# Altium schematic sheet Eth.SchDoc
size A3
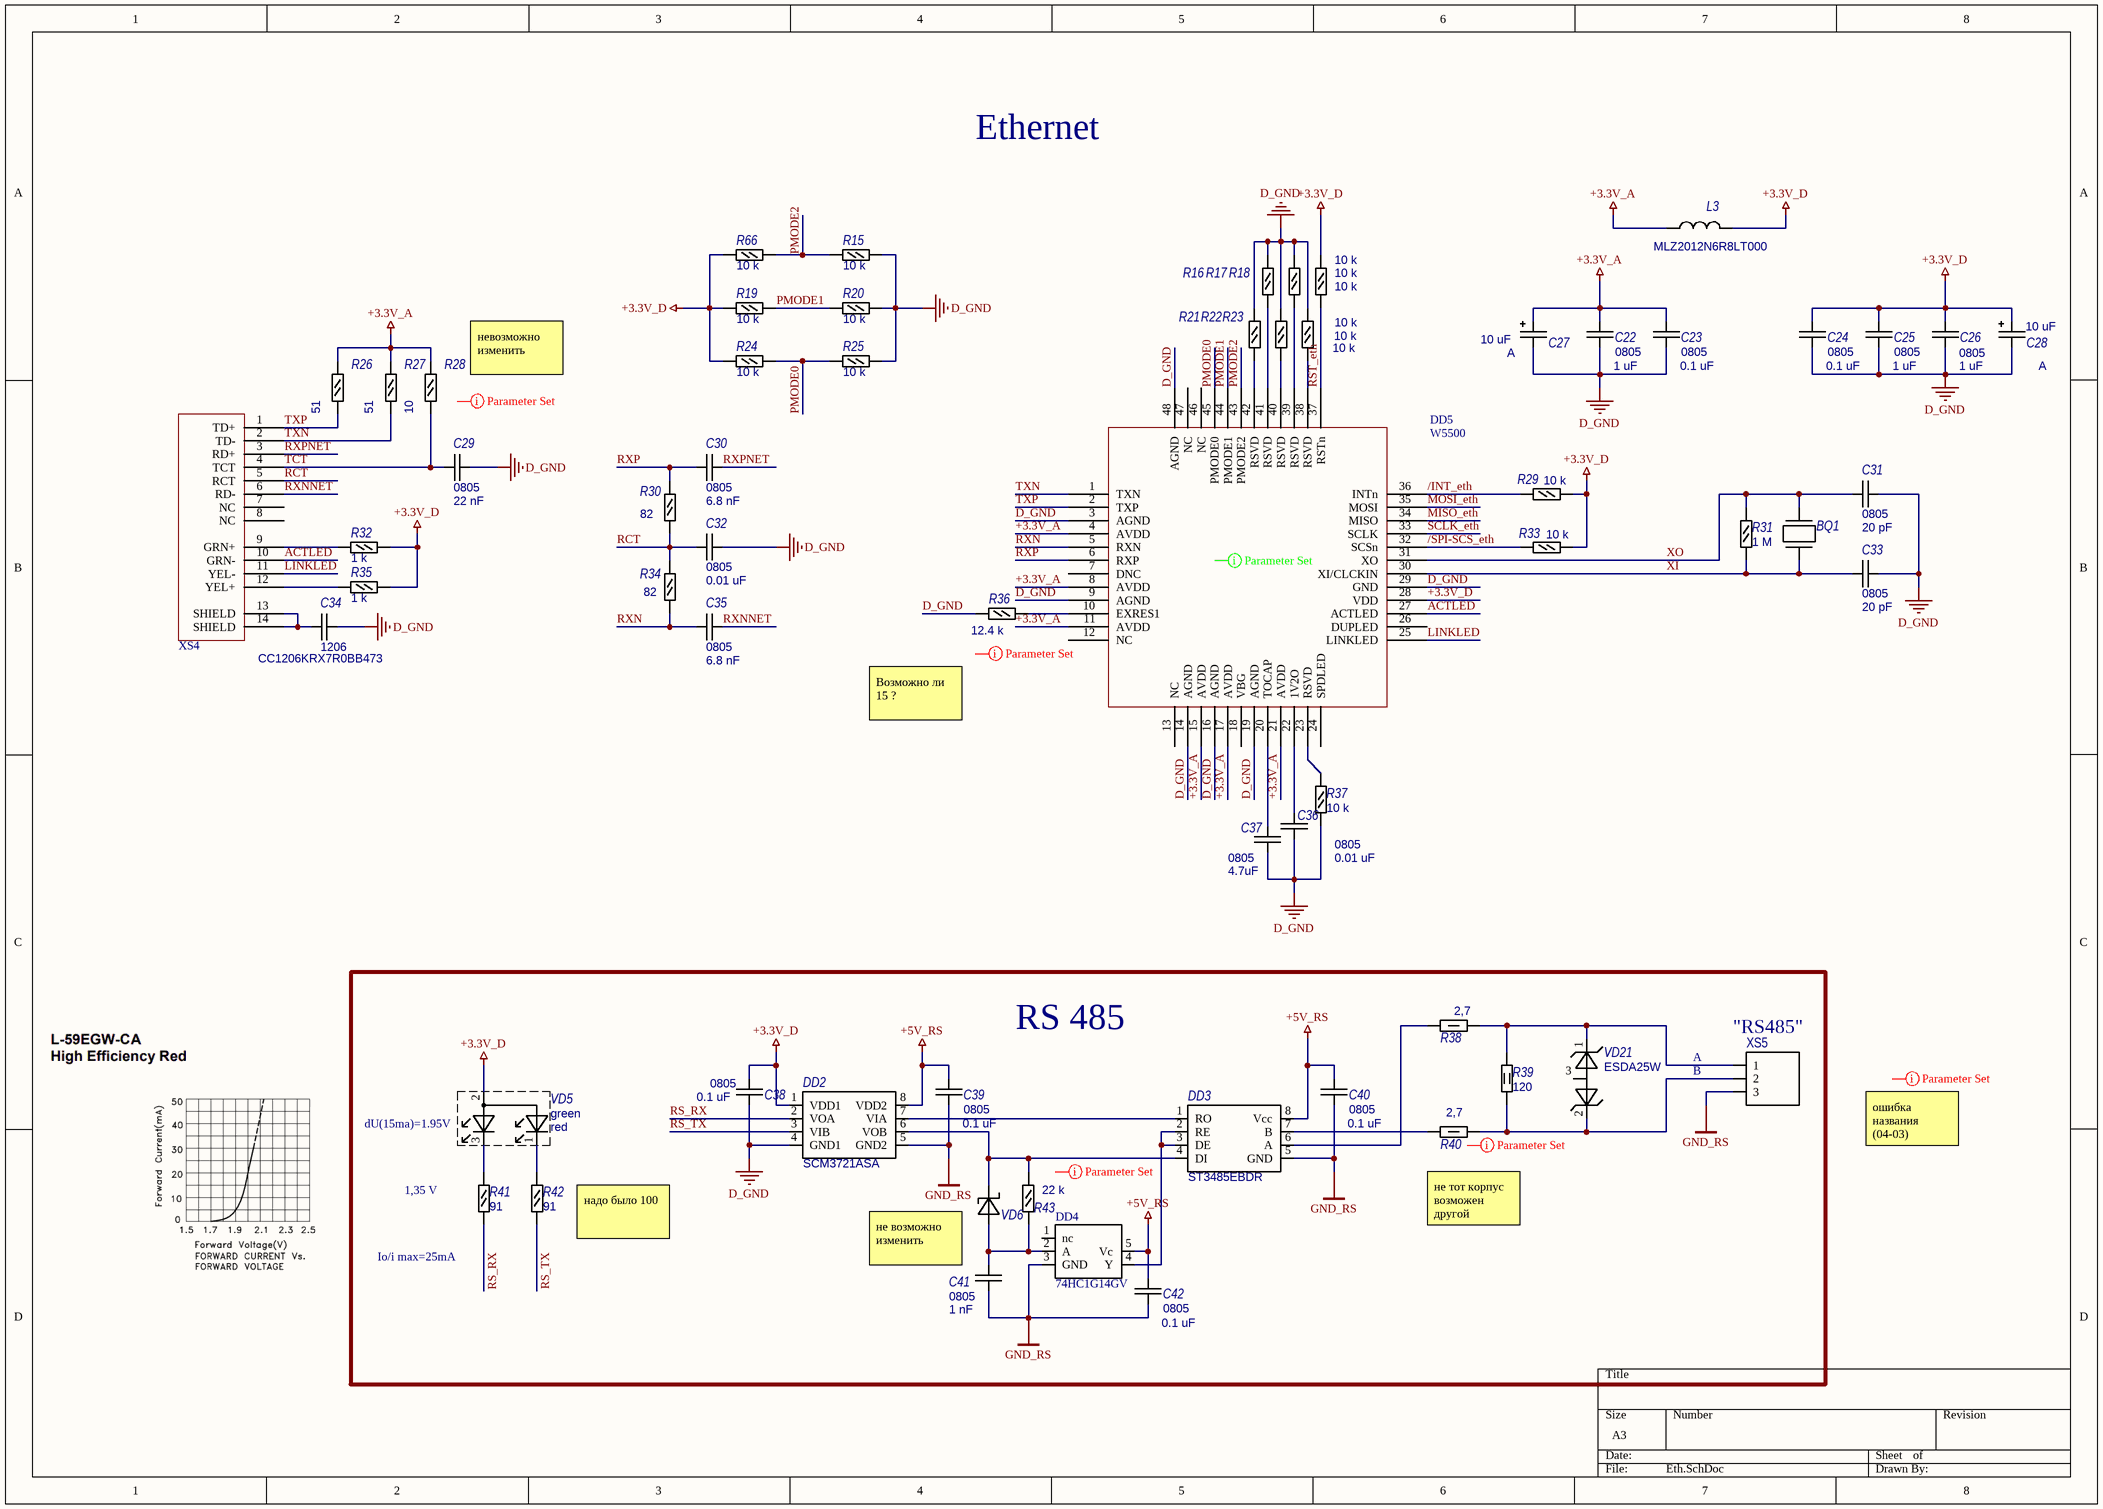
[diagram p0: Eth.SchDoc]

## Parts
BQ1  (no value)  [Xtal_HC49S]
C22  0805  Номинал: 1 uF  [CAP_0805_(2x1.25x1.3)]
C23  0805  Номинал: 0.1 uF  [CAP_0805_(2x1.25x1.3)]
C24  0805  Номинал: 0.1 uF  [CAP_0805_(2x1.25x1.3)]
C25  0805  Номинал: 1 uF  [CAP_0805_(2x1.25x1.3)]
C26  0805  Номинал: 1 uF  [CAP_0805_(2x1.25x1.3)]
C27  Корпус: A  Номинал: 10 uF  [CAP_TAN_A]  (hidden comment: TAN_A)
C28  Корпус: A  Номинал: 10 uF  [CAP_TAN_A]  (hidden comment: TAN_A)
C29  0805  Номинал: 22 nF  [CAP_0805_(2x1.25x1.3)]
C30  0805  Номинал: 6.8 nF  [CAP_0805_(2x1.25x1.3)]
C31  0805  Номинал: 20 pF  [CAP_0805_(2x1.25x1.3)]
C32  0805  Номинал: 0.01 uF  [CAP_0805_(2x1.25x1.3)]
C33  0805  Номинал: 20 pF  [CAP_0805_(2x1.25x1.3)]
C34  1206  Наименование: CC1206KRX7R0BB473  [CAP_1206_(3.2x1.6x1.5)]
C35  0805  Номинал: 6.8 nF  [CAP_0805_(2x1.25x1.3)]
C36  0805  Номинал: 0.01 uF  [CAP_0805_(2x1.25x1.3)]
C37  0805  Номинал: 4.7uF  [CAP_0805_(2x1.25x1.3)]
C38  0805  Номинал: 0.1 uF  [CAP_0805_(2x1.25x1.3)]
C39  0805  Номинал: 0.1 uF  [CAP_0805_(2x1.25x1.3)]
C40  0805  Номинал: 0.1 uF  [CAP_0805_(2x1.25x1.3)]
C41  0805  Номинал: 1 nF  [CAP_0805_(2x1.25x1.3)]
C42  0805  Номинал: 0.1 uF  [CAP_0805_(2x1.25x1.3)]
DD2  SCM3721ASA  [SOP-8]
DD3  ST3485EBDR  [SO-8_(0.15')]
DD4  74HC1G14GV  [sot-23-5]
DD5  W5500  [LQFP_48]
L3  Наименование: MLZ2012N6R8LT000  [L_0805]  (hidden comment: PBY201209T-601Y-N)
R15  Номинал: 10 k  [RES_0805_(2x1.2x0.45)_0.125Вт]  (hidden comment: 0805)
R16  Номинал: 10 k  [RES_0805_(2x1.2x0.45)_0.125Вт]  (hidden comment: 0805)
R17  Номинал: 10 k  [RES_0805_(2x1.2x0.45)_0.125Вт]  (hidden comment: 0805)
R18  Номинал: 10 k  [RES_0805_(2x1.2x0.45)_0.125Вт]  (hidden comment: 0805)
R19  Номинал: 10 k  [RES_0805_(2x1.2x0.45)_0.125Вт]  (hidden comment: 0805)
R20  Номинал: 10 k  [RES_0805_(2x1.2x0.45)_0.125Вт]  (hidden comment: 0805)
R21  Номинал: 10 k  [RES_0805_(2x1.2x0.45)_0.125Вт]  (hidden comment: 0805)
R22  Номинал: 10 k  [RES_0805_(2x1.2x0.45)_0.125Вт]  (hidden comment: 0805)
R23  Номинал: 10 k  [RES_0805_(2x1.2x0.45)_0.125Вт]  (hidden comment: 0805)
R24  Номинал: 10 k  [RES_0805_(2x1.2x0.45)_0.125Вт]  (hidden comment: 0805)
R25  Номинал: 10 k  [RES_0805_(2x1.2x0.45)_0.125Вт]  (hidden comment: 0805)
R26  Номинал: 51  [RES_0805_(2x1.2x0.45)_0.125Вт]  (hidden comment: 0805)
R27  Номинал: 51  [RES_0805_(2x1.2x0.45)_0.125Вт]  (hidden comment: 0805)
R28  Номинал: 10  [RES_0805_(2x1.2x0.45)_0.125Вт]  (hidden comment: 0805)
R29  Номинал: 10 k  [RES_0805_(2x1.2x0.45)_0.125Вт]  (hidden comment: 0805)
R30  Номинал: 82  [RES_0805_(2x1.2x0.45)_0.125Вт]  (hidden comment: 0805)
R31  Номинал: 1 M  [RES_0805_(2x1.2x0.45)_0.125Вт]  (hidden comment: 0805)
R32  Номинал: 1 k  [RES_0805_(2x1.2x0.45)_0.125Вт]  (hidden comment: 0805)
R33  Номинал: 10 k  [RES_0805_(2x1.2x0.45)_0.125Вт]  (hidden comment: 0805)
R34  Номинал: 82  [RES_0805_(2x1.2x0.45)_0.125Вт]  (hidden comment: 0805)
R35  Номинал: 1 k  [RES_0805_(2x1.2x0.45)_0.125Вт]  (hidden comment: 0805)
R36  Номинал: 12.4 k  [RES_0805_(2x1.2x0.45)_0.125Вт]  (hidden comment: 0805)
R37  Номинал: 10 k  [RES_0805_(2x1.2x0.45)_0.125Вт]  (hidden comment: 0805)
R38  Номинал: 2,7  [RES_1210_(3.2x2.5x0.55)_0.5Вт]  (hidden comment: 1210)
R39  Номинал: 120  [RES_2512_(6.3x3.1x0.6)_2Вт]  (hidden comment: 2512)
R40  Номинал: 2,7  [RES_1210_(3.2x2.5x0.55)_0.5Вт]  (hidden comment: 1210)
R41  Номинал: 91  [RES_0805_(2x1.2x0.45)_0.125Вт]  (hidden comment: 0805)
R42  Номинал: 91  [RES_0805_(2x1.2x0.45)_0.125Вт]  (hidden comment: 0805)
R43  Номинал: 22 k  [RES_0805_(2x1.2x0.45)_0.125Вт]  (hidden comment: 0805)
R66  Номинал: 10 k  [RES_0805_(2x1.2x0.45)_0.125Вт]  (hidden comment: 0805)
VD5  Тип: green  Примечания: red  [VD_LEDsx2]  (hidden comment: VD_Ledx2_dip)
VD6  VD_SH_SMA  [VD_SMA_(Do-214AC)]  (value not drawn)
VD21  ESDA25W  [SOT-323-3L]
XS4  XS_HR911105A  [XS_HR911105A(RJ45)]  (value not drawn)
XS5  XS_3_pin_3.8mm  [XS_3_Pin _3.8mm]  (value not drawn)

## Blocks framed on the sheet
RS 485: C38-C42 DD2-DD4 R38-R43 VD5 VD6 VD21 XS5

## Nets
+3.3V_A: C22.2 C23.2 C27.1 DD5.4(AVDD) DD5.8(AVDD) DD5.11(AVDD) DD5.15(AVDD) DD5.17(AVDD) DD5.21(AVDD) L3.1 R26.2 R27.2 R28.2
+3.3V_D: C24.2 C25.2 C26.2 C28.1 C38.2 DD2.1(VDD1) DD5.28(VDD) L3.2 R18.2 R19.1 R24.1 R29.2 R32.2 R33.2 R35.2 R66.1 VD5.2(A)
+5V_RS: C39.2 C40.2 C42.2 DD2.8(VDD2) DD3.8(Vcc) DD4.5(Vc)
D_GND: C22.1 C23.1 C24.1 C25.1 C26.1 C27.2 C28.2 C29.1 C31.1 C32.1 C33.1 C34.2 C36.1 C37.1 C38.1 DD2.4(GND1) DD5.3(AGND) DD5.9(AGND) DD5.14(AGND) DD5.16(AGND) DD5.19(AGND) DD5.29(GND) DD5.48(AGND) R15.2 R16.2 R17.2 R20.2 R21.2 R22.2 R23.2 R25.2 R36.1 R37.1
GND_RS: C39.1 C40.1 C41.1 C42.1 DD2.5(GND2) DD3.5(GND) DD4.3(GND) XS5.3
/INT_eth: DD5.36(INTn) R29.1
/SPI-SCS_eth: DD5.32(SCSn) R33.1
ACTLED: DD5.27(ACTLED) XS4.10(GRN-)
LINKLED: DD5.25(LINKLED) XS4.11(YEL-)
MISO_eth: DD5.34(MISO)
MOSI_eth: DD5.35(MOSI)
PMODE0: DD5.45(PMODE0) R24.2 R25.1
PMODE1: DD5.44(PMODE1) R19.2 R20.1
PMODE2: DD5.43(PMODE2) R15.1 R66.2
RCT: C32.2 R30.1 R34.2 XS4.5(RCT)
RS_RX: DD2.2(VOA) R41.1
RS_TX: DD2.3(VIB) R42.1
RST_eth: DD5.37(RSTn) R18.1
RXN: C35.2 DD5.5(RXN) R34.1
RXNNET: C35.1 XS4.6(RD-)
RXP: C30.2 DD5.6(RXP) R30.2
RXPNET: C30.1 XS4.3(RD+)
SCLK_eth: DD5.33(SCLK)
TCT: C29.2 R28.1 XS4.4(TCT)
TXN: DD5.1(TXN) R27.1 XS4.2(TD-)
TXP: DD5.2(TXP) R26.1 XS4.1(TD+)
XI: BQ1.1 C33.2 DD5.30(XI/CLCKIN) R31.1
XO: BQ1.2 C31.2 DD5.31(XO) R31.2
NetC34_1: C34.1 XS4.13(SHIELD) XS4.14(SHIELD)
NetC36_2: C36.2 DD5.22(1V2O)
NetC37_2: C37.2 DD5.20(TOCAP)
NetC41_2: C41.2 DD4.2(A) R43.2 VD6.1(A)
NetDD2_6: DD2.6(VOB) DD3.4(DI) R43.1 VD6.2(K)
NetDD2_7: DD2.7(VIA) DD3.1(RO)
NetDD3_2: DD3.2(RE) DD3.3(DE) DD4.4(Y)
NetDD3_6: DD3.6(A) R38.1
NetDD3_7: DD3.7(B) R40.1
NetDD5_10: DD5.10(EXRES1) R36.2
NetDD5_23: DD5.23(RSVD) R37.2
NetDD5_38: DD5.38(RSVD) R23.1
NetDD5_39: DD5.39(RSVD) R17.1
NetDD5_40: DD5.40(RSVD) R22.1
NetDD5_41: DD5.41(RSVD) R16.1
NetDD5_42: DD5.42(RSVD) R21.1
NetR32_1: R32.1 XS4.9(GRN+)
NetR35_1: R35.1 XS4.12(YEL+)
NetR38_2: R38.2 R39.2 VD21.1 XS5.1
NetR39_1: R39.1 R40.2 VD21.2 XS5.2
NetR41_2: R41.2 VD5.3(K2)
NetR42_2: R42.2 VD5.1(K1)

Not connected (* = marked no-connect by the designer): DD4 1(nc); DD5 7(DNC) 12(NC) 13(NC) 18(VBG) 24(SPDLED) 26(DUPLED) 46(NC) 47(NC); VD21 3; XS4 7(NC) 8(NC)

## Notes on the sheet
- Ethernet
- (near R28) невозможно изменить
- Возможно ли 15 ?
- (near XS5) "RS485"
- (near VD5) dU(15ma)=1.95V
- (near XS5) A
- (near XS5) B
- 1,35 V
- ошибка названия (04-03)
- (near R41) Io/i max=25mA
- (near R42) надо было 100
- не возможно изменить
- (near R40) не тот корпус
  возможен другой номинал

## Library data of the parts
BQ1 = Xtal: Корпус: HC-49S; Наименование: HC-49S 25 MHz; Номинал: 25Mhz; Поставщик: chipdip; Аналог: 25.000 МГц HC-49S; Идентификатор: HC-49S 25 MHz
C22 C25 C26 = C_0805: Керамика; Тип: Конденсатор; Наименование: TCC0805X7R105K500FT; Аналог: GRM21BR71H105K; Корпус: 0805; Идентификатор: TCC0805X7R105K500FT
C23 C24 C38-C40 C42 = C_0805: Керамика; Тип: Конденсатор; Наименование: CC0805KRX7R9BB104; Аналог: GRM21BR71H104K; Корпус: 0805; Идентификатор: CC0805KRX7R9BB104
C27 C28 = C+_TAN_A: Capacitor; Тип: Конденсатор; Наименование: CA45-A020K106T
C29 = C_0805: Керамика; Тип: Конденсатор; Наименование: TCC0805X7R223K500DT; Аналог: GRM216R71H223K; Корпус: 0805; Идентификатор: TCC0805X7R223K500DT
C30 C35 = C_0805: Керамика; Тип: Конденсатор; Наименование: TCC0805X7R682K500DT; Аналог: GRM2195C1H682JA01D; Корпус: 0805; Идентификатор: TCC0805X7R682K500DT
C31 C33 = C_0805: Керамика; Тип: Конденсатор; Наименование: TCC0805COG200J500BT; Аналог: GRM2165C1H200J; Корпус: 0805; Идентификатор: TCC0805COG200J500BT
C32 C36 = C_0805: Керамика; Тип: Конденсатор; Наименование: TCC0805X7R103J500DT; Parameter 1: GRM2195C1H103J; Корпус: 0805; Идентификатор: TCC0805X7R103J500DT
C34 = C_1206: Керамика; Тип: Конденсатор; Напряжение: 250 В; Номинал: 0.047 uF; Аналог: GRM31CR72E473K; Корпус: 1206; Идентификатор: CC1206KRX7R0BB473
C37 = C_0805: Керамика; Тип: Конденсатор; Наименование: TCC0805X5R475K500FT; Аналог: GRM21BR61E475K; Корпус: 0805; Идентификатор: TCC0805X5R475K500FT
C41 = C_0805: Керамика; Тип: Конденсатор; Наименование: TCC0805X7R102K500DT; Аналог: GRM216R71H102K; Корпус: 0805; Идентификатор: TCC0805X7R102K500DT
DD2 = DD_SCM3721ASA: Dual-ChannelDigital Isolators; Тип: SCM3721ASA; Наименование: SCM3721ASA
DD3 = DD_ST3485EBDR: RS485/422 Приемопередатчик интерфейса; Тип: ST3485EBDR; Наименование: ST3485EBDR; Идентификатор: ST3485EBDR
DD4 = DD_74HC1G14GV: 1 канал инвертирующ триггер шмитта; Наименование: 74HC1G14GV
DD5 = DD_W5500: Поставщик: chipdip; Наименование: W5500
L3 = L_PBY201209T-601Y-N: L; Тип: Индуктивность
R15-R25 R29 R33 R37 R66 = R_0805: Resistor; Тип: Резистор; Наименование: RC0805JR-0710KL; Корпус: 0805; Идентификатор: RC0805JR-0710KL
R26 R27 = R_0805: Resistor; Тип: Резистор; Наименование: RC0805JR-0751RL; Корпус: 0805; Идентификатор: RC0805JR-0751RL
R28 = R_0805: Resistor; Тип: Резистор; Наименование: RC0805JR-0710RL; Корпус: 0805; Идентификатор: RC0805JR-0710RL
R30 R34 = R_0805: Resistor; Тип: Резистор; Наименование: RC0805JR-0782RL; Корпус: 0805; Идентификатор: RC0805JR-0782RL
R31 = R_0805: Resistor; Тип: Резистор; Наименование: RC0805JR-071ML; Корпус: 0805; Идентификатор: RC0805JR-071ML
R32 R35 = R_0805: Resistor; Тип: Резистор; Наименование: RC0805JR-071KL; Корпус: 0805; Идентификатор: RC0805JR-071KL
R36 = R_0805: Resistor; Тип: Резистор; Наименование: RC0805FR-0712K4L; Примечания: 1%; Корпус: 0805; Идентификатор: RC0805FR-0712K4L
R38 R40 = R_1210: Resistor; Тип: Резистор; Корпус: 1206; Наименование: RC1206JR-072R7L; Идентификатор: RC1206JR-072R7L
R39 = R_2512: Токочувствительные резисторы – для поверхностного монтажа 2watts 2512; Наименование: RC2512JK-07120RL; Тип: Резистор; Корпус: 2512; Идентификатор: RC2512JK-07120RL
R41 R42 = R_0805: Resistor; Тип: Резистор; Наименование: RC0805JR-0791RL; Корпус: 0805; Идентификатор: RC0805JR-0791RL
R43 = R_0805: Resistor; Тип: Резистор; Наименование: RC0805JR-0722KL; Корпус: 0805; Идентификатор: RC0805JR-0722KL
VD5 = VD_Ledx2_dip: Наименование: L-59EGW-CA
VD6 = VD_SH_SMA: Sh_Diode; Тип: Диод Шоттки; Корпус: SMA; Наименование: 10MQ030NPBF; Напряжение: 30В; Номинал: 1А; Поставщик: chipdip
VD21 = VD_ESDA25W: Защитный биполярный диод; Тип: ESDA25W; Корпус: SOT-323-3L; Наименование: ESDA25W
XS4 = XS_HR911105A: RJ45; Наименование: HR911105A
XS5 = XS_3_pin_3.8mm: Наименование: 15EDGRC-3.81-04; Примечания: 15EDGK-3.81-04